# Altium schematic sheet Leningrad.SchDoc
size A1
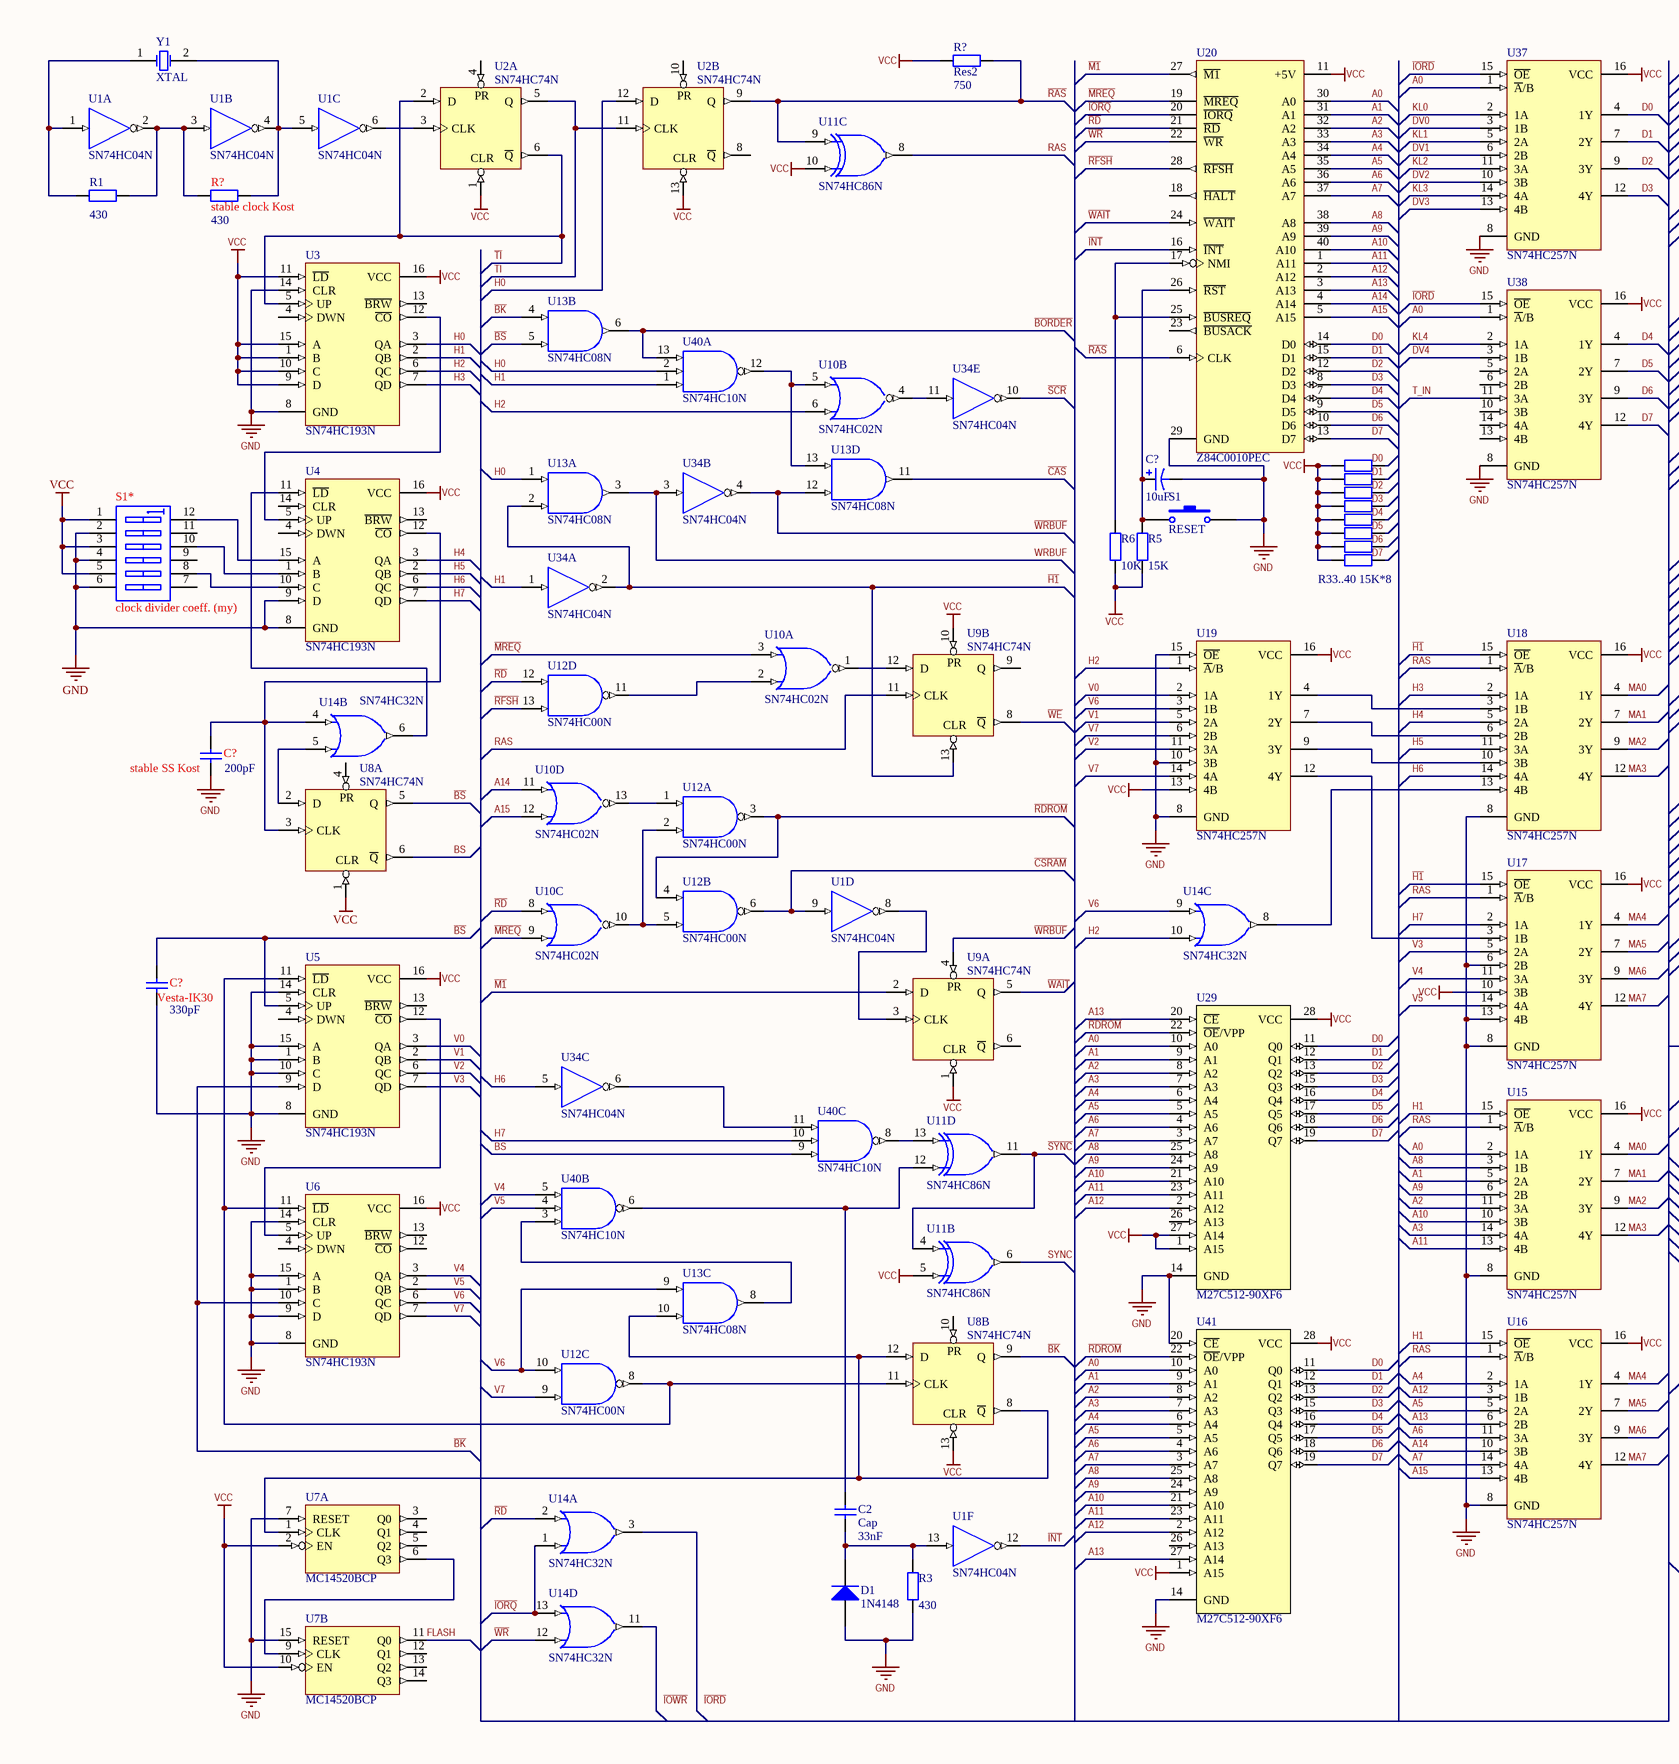
[diagram p0: Leningrad.SchDoc, left]
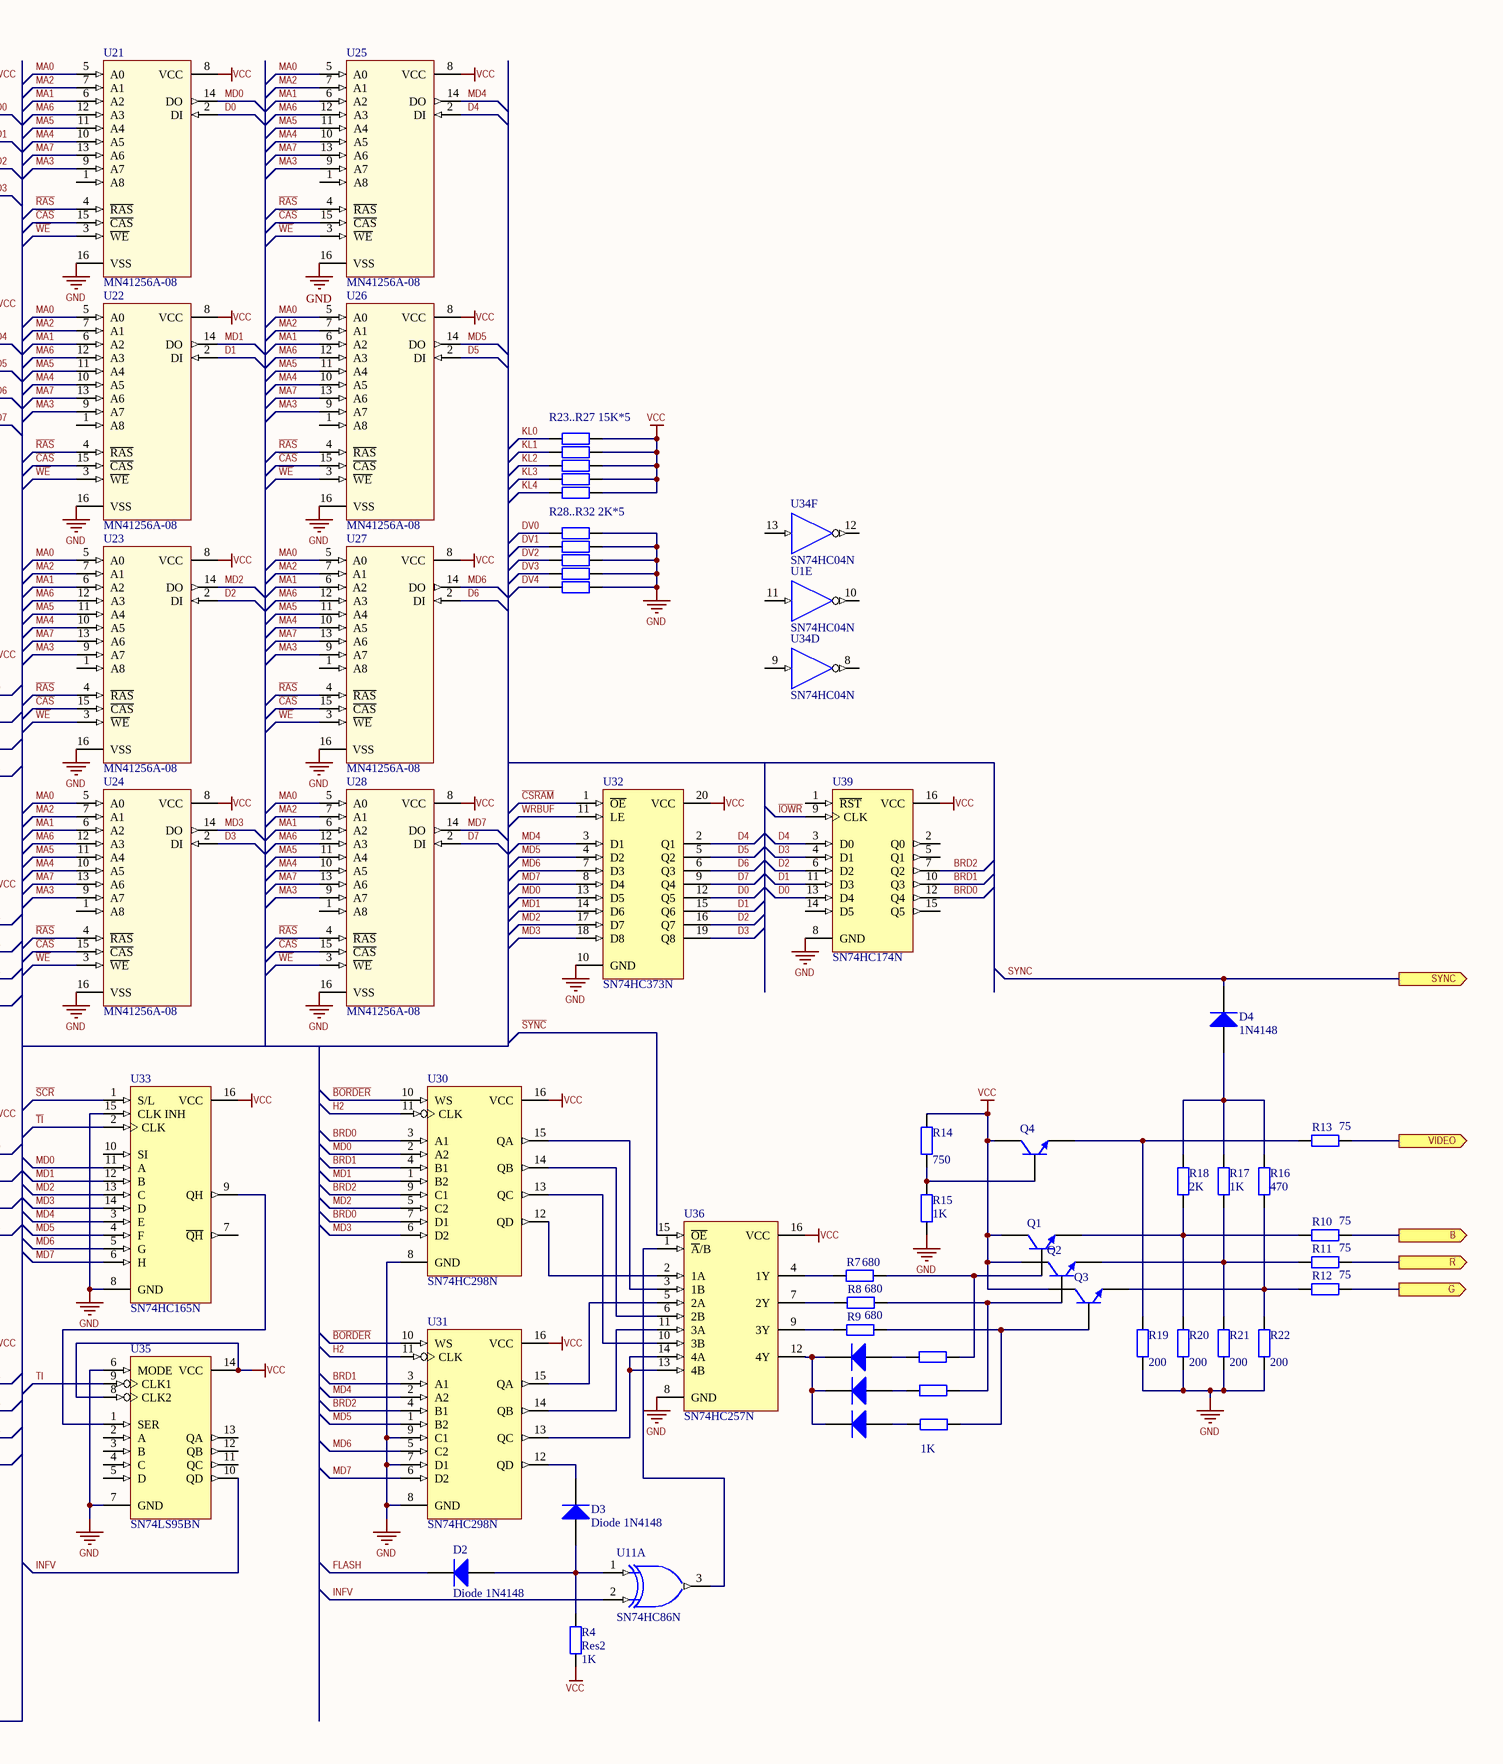
[diagram p1: Leningrad.SchDoc, right]

## Parts
(Parts that share a designator on the sheet are numbered #1, #2 ... from top to bottom, then left to right.)
C2  Cap  value 33nF  [RAD-0.3]
C?#1  value 10uF  [RB7.6-15]  (hidden comment: Cap Pol1)
C?#2  stable SS Kost  value 200pF  [RAD-0.3]
C?#3  Vesta-IK30  value 330pF  [RAD-0.3]
D1  1N4148  [DO-35]
D2  Diode 1N4148  [DO-35]
D3  Diode 1N4148  [DO-35]
D4  1N4148  [DO-35]
D5  1N4148  [DO-35]  (value not drawn)
D6  1N4148  [DO-35]  (value not drawn)
D7  1N4148  [DO-35]  (value not drawn)
Q1  2N3904  [TO-92A]  (value not drawn)
Q2  2N3904  [TO-92A]  (value not drawn)
Q3  2N3904  [TO-92A]  (value not drawn)
Q4  2N3904  [TO-92A]  (value not drawn)
R1  value 430  [AXIAL-0.4]  (hidden comment: Res2)
R3  value 430  [AXIAL-0.4]  (hidden comment: Res2)
R4  Res2  value 1K  [AXIAL-0.4]
R5  value 15K  [AXIAL-0.4]  (hidden comment: Res2)
R6  value 10K  [AXIAL-0.4]  (hidden comment: Res2)
R7  value 680  [AXIAL-0.4]  (hidden comment: Res2)
R8  value 680  [AXIAL-0.4]  (hidden comment: Res2)
R9  value 680  [AXIAL-0.4]  (hidden comment: Res2)
R10  value 75  [AXIAL-0.4]  (hidden comment: Res2)
R11  value 75  [AXIAL-0.4]  (hidden comment: Res2)
R12  value 75  [AXIAL-0.4]  (hidden comment: Res2)
R13  value 75  [AXIAL-0.4]  (hidden comment: Res2)
R14  value 750  [AXIAL-0.4]  (hidden comment: Res2)
R15  value 1K  [AXIAL-0.4]  (hidden comment: Res2)
R16  value 470  [AXIAL-0.4]  (hidden comment: Res2)
R17  value 1K  [AXIAL-0.4]  (hidden comment: Res2)
R18  value 2K  [AXIAL-0.4]  (hidden comment: Res2)
R19  value 200  [AXIAL-0.4]  (hidden comment: Res2)
R20  value 200  [AXIAL-0.4]  (hidden comment: Res2)
R21  value 200  [AXIAL-0.4]  (hidden comment: Res2)
R22  value 200  [AXIAL-0.4]  (hidden comment: Res2)
R23  Res2  [AXIAL-0.4]  (value not drawn)
R24  Res2  [AXIAL-0.4]  (value not drawn)
R25  Res2  [AXIAL-0.4]  (value not drawn)
R26  Res2  [AXIAL-0.4]  (value not drawn)
R27  Res2  [AXIAL-0.4]  (value not drawn)
R28  Res2  [AXIAL-0.4]  (value not drawn)
R29  Res2  [AXIAL-0.4]  (value not drawn)
R30  Res2  [AXIAL-0.4]  (value not drawn)
R31  Res2  [AXIAL-0.4]  (value not drawn)
R32  Res2  [AXIAL-0.4]  (value not drawn)
R33  Res2  [AXIAL-0.4]  (value not drawn)
R34  Res2  [AXIAL-0.4]  (value not drawn)
R35  Res2  [AXIAL-0.4]  (value not drawn)
R36  Res2  [AXIAL-0.4]  (value not drawn)
R37  Res2  [AXIAL-0.4]  (value not drawn)
R38  Res2  [AXIAL-0.4]  (value not drawn)
R39  Res2  [AXIAL-0.4]  (value not drawn)
R40  Res2  [AXIAL-0.4]  (value not drawn)
R41  Res2  [AXIAL-0.4]  (value not drawn)
R42  Res2  [AXIAL-0.4]  (value not drawn)
R43  value 1K  [AXIAL-0.4]  (hidden comment: Res2)
R?#1  Res2  value 750  [AXIAL-0.4]
R?#2  stable clock Kost  value 430  [AXIAL-0.4]
S1  RESET  [SPST-2]
S1*  clock divider coeff. (my)  [DIP-12/SW]  (graphical)
U1  SN74HC04N  [N014]  (parts A,B,C,D,E,F of 6)
U2  SN74HC74N  [N014]  (parts A,B of 2)
U3  SN74HC193N  [N016]
U4  SN74HC193N  [N016]
U5  SN74HC193N  [N016]
U6  SN74HC193N  [N016]
U7  MC14520BCP  [648-08]  (parts A,B of 2)
U8  SN74HC74N  [N014]  (parts A,B of 2)
U9  SN74HC74N  [N014]  (parts A,B of 2)
U10  SN74HC02N  [N014]  (parts A,B,C,D of 4)
U11  SN74HC86N  [N014]  (parts A,B,C,D of 4)
U12  SN74HC00N  [N014]  (parts A,B,C,D of 4)
U13  SN74HC08N  [N014]  (parts A,B,C,D of 4)
U14  SN74HC32N  [N014]  (parts A,B,C,D of 4)
U15  SN74HC257N  [N016]
U16  SN74HC257N  [N016]
U17  SN74HC257N  [N016]
U18  SN74HC257N  [N016]
U19  SN74HC257N  [N016]
U20  Z84C0010PEC  [PDIP40]
U21  MN41256A-08
U22  MN41256A-08
U23  MN41256A-08
U24  MN41256A-08
U25  MN41256A-08
U26  MN41256A-08
U27  MN41256A-08
U28  MN41256A-08
U29  M27C512-90XF6  [FDIP28W]
U30  SN74HC298N  [N016D]
U31  SN74HC298N  [N016D]
U32  SN74HC373N  [N020]
U33  SN74HC165N  [N016]
U34  SN74HC04N  [N014]  (parts A,B,C,D,E,F of 6)
U35  SN74LS95BN  [N014]
U36  SN74HC257N  [N016]
U37  SN74HC257N  [N016]
U38  SN74HC257N  [N016]
U39  SN74HC174N  [N016]
U40  SN74HC10N  [N014]  (parts A,B,C of 3)
U41  M27C512-90XF6  [FDIP28W]
Y1  XTAL  [R38]

## Ports
B (out), G (out), R (out), SYNC (out), VIDEO (out)

## Nets
GND: C?#1.2 C?#2.1 C?#3.1 D1.1(A) R3.1 R15.1 R19.1 R20.1 R21.1 R22.1 R28.2 R29.2 R30.2 R31.2 R32.2 S1.2 S1*.2(A2) S1*.4(A4) S1*.6(A6) U1.7(GND) U2.7(GND) U3.8(GND) U3.14(CLR) U4.8(GND) U4.9(D) U5.1(B) U5.8(GND) U5.10(C) U5.14(CLR) U5.15(A) U6.1(B) U6.8(GND) U6.9(D) U6.14(CLR) U6.15(A) U7.7(RESET) U7.8(GND) U7.15(RESET) U8.7(GND) U9.7(GND) U10.7(GND) U11.7(GND) U12.7(GND) U13.7(GND) U14.7(GND) U15.8(GND) U16.8(GND) U17.6(2B) U17.8(GND) U17.13(4B) U18.8(GND) U19.8(GND) U19.10(3B) U19.15(~{OE}) U20.29(GND) U21.16(VSS) U22.16(VSS) U23.16(VSS) U24.16(VSS) U25.16(VSS) U26.16(VSS) U27.16(VSS) U28.16(VSS) U29.14(GND) U30.8(GND) U31.7(D1) U31.8(GND) U31.9(C1) U32.10(GND) U33.8(GND) U33.15(CLK_INH) U34.7(GND) U35.6(MODE) U35.7(GND) U36.8(GND) U37.8(GND) U38.8(GND) U39.8(GND) U40.7(GND) U41.14(GND) U41.20(~{CE})
VCC: Q1.3(C) Q2.3(C) Q3.3(C) Q4.3(C) R4.1 R5.1 R6.1 R14.2 R23.2 R24.2 R25.2 R26.2 R27.2 R33.1 R34.1 R35.1 R36.1 R37.1 R38.1 R39.1 R40.1 R?#1.1 S1*.1(A1) S1*.3(A3) S1*.5(A5) U1.14(VCC) U2.1(CLR) U2.13(CLR) U2.14(VCC) U3.1(B) U3.9(D) U3.10(C) U3.11(~{LD}) U3.15(A) U3.16(VCC) U4.16(VCC) U5.16(VCC) U6.16(VCC) U7.2(EN) U7.10(EN) U8.1(CLR) U8.13(CLR) U8.14(VCC) U9.1(CLR) U9.10(PR) U9.14(VCC) U10.14(VCC) U11.5(B) U11.10(B) U11.14(VCC) U12.14(VCC) U13.14(VCC) U14.14(VCC) U15.16(VCC) U16.16(VCC) U17.10(3B) U17.16(VCC) U18.16(VCC) U19.13(4B) U19.16(VCC) U20.11(+5V) U21.8(VCC) U22.8(VCC) U23.8(VCC) U24.8(VCC) U25.8(VCC) U26.8(VCC) U27.8(VCC) U28.8(VCC) U29.1(A15) U29.27(A14) U29.28(VCC) U30.16(VCC) U31.16(VCC) U32.20(VCC) U33.16(VCC) U34.14(VCC) U35.8(CLK2) U35.14(VCC) U36.16(VCC) U37.16(VCC) U38.16(VCC) U39.16(VCC) U40.14(VCC) U41.1(A15) U41.28(VCC)
VDD: U7.16(VDD)
A0: U15.2(1A) U20.30(A0) U29.10(A0) U37.1(~{A}/B) U38.1(~{A}/B) U41.10(A0)
A1: U15.5(2A) U20.31(A1) U29.9(A1) U41.9(A1)
A2: U15.11(3A) U20.32(A2) U29.8(A2) U41.8(A2)
A3: U15.14(4A) U20.33(A3) U29.7(A3) U41.7(A3)
A4: U16.2(1A) U20.34(A4) U29.6(A4) U41.6(A4)
A5: U16.5(2A) U20.35(A5) U29.5(A5) U41.5(A5)
A6: U16.11(3A) U20.36(A6) U29.4(A6) U41.4(A6)
A7: U16.14(4A) U20.37(A7) U29.3(A7) U41.3(A7)
A8: U15.3(1B) U20.38(A8) U29.25(A8) U41.25(A8)
A9: U15.6(2B) U20.39(A9) U29.24(A9) U41.24(A9)
A10: U15.10(3B) U20.40(A10) U29.21(A10) U41.21(A10)
A11: U15.13(4B) U20.1(A11) U29.23(A11) U41.23(A11)
A12: U16.3(1B) U20.2(A12) U29.2(A12) U41.2(A12)
A13: U16.6(2B) U20.3(A13) U29.20(~{CE}) U41.27(A14)
A14: U10.11(A) U16.10(3B) U20.4(A14)
A15: U10.12(B) U16.13(4B) U20.5(A15)
B: R10.2 ; port B
~{BK}: U5.9(D) U6.10(C) U8.9(Q) U13.4(A)
~{BORDER}: U13.6(Y) U30.10(WS) U31.10(WS) U40.13(C)
~{BS}: C?#3.2 U5.5(UP) U8.5(Q) U13.5(B)
BRD0: U30.3(A1) U30.7(D1) U39.12(Q4)
BRD1: U30.4(B1) U31.3(A1) U39.10(Q3)
BRD2: U30.9(C1) U31.4(B1) U39.7(Q2)
BS: U8.6(~{Q}) U40.9(A)
~{CAS}: U13.11(Y) U21.15(~{CAS}) U22.15(~{CAS}) U23.15(~{CAS}) U24.15(~{CAS}) U25.15(~{CAS}) U26.15(~{CAS}) U27.15(~{CAS}) U28.15(~{CAS})
~{CSRAM}: U1.9(A) U12.6(Y) U32.1(~{OE})
D0: U20.14(D0) U21.2(DI) U29.11(Q0) U32.12(Q5) U37.4(1Y) U39.13(D4) U41.11(Q0)
D1: U20.15(D1) U22.2(DI) U29.12(Q1) U32.15(Q6) U37.7(2Y) U39.11(D3) U41.12(Q1)
D2: U20.12(D2) U23.2(DI) U29.13(Q2) U32.16(Q7) U37.9(3Y) U39.6(D2) U41.13(Q2)
D3: U20.8(D3) U24.2(DI) U29.15(Q3) U32.19(Q8) U37.12(4Y) U39.4(D1) U41.15(Q3)
D4: U20.7(D4) U25.2(DI) U29.16(Q4) U32.2(Q1) U38.4(1Y) U39.3(D0) U41.16(Q4)
D5: U20.9(D5) U26.2(DI) U29.17(Q5) U32.5(Q2) U38.7(2Y) U41.17(Q5)
D6: U20.10(D6) U27.2(DI) U29.18(Q6) U32.6(Q3) U38.9(3Y) U41.18(Q6)
D7: U20.13(D7) U28.2(DI) U29.19(Q7) U32.9(Q4) U38.12(4Y) U41.19(Q7)
DV0: R28.1 U37.3(1B)
DV1: R29.1 U37.6(2B)
DV2: R30.1 U37.10(3B)
DV3: R31.1 U37.13(4B)
DV4: R32.1 U38.3(1B)
FLASH: D2.2(K) U7.11(Q0)
G: R12.2 ; port G
H0: U2.12(D) U3.3(QA) U13.1(A) U40.2(B)
H1: U3.2(QB) U15.15(~{OE}) U16.15(~{OE}) U34.1(A) U40.1(A)
H2: U3.6(QC) U10.6(B) U14.10(B) U19.1(~{A}/B) U30.11(CLK) U31.11(CLK)
H3: U3.7(QD) U18.2(1A)
H4: U4.3(QA) U18.5(2A)
H5: U4.2(QB) U18.11(3A)
H6: U4.6(QC) U18.14(4A) U34.5(A)
H7: U4.7(QD) U17.2(1A) U40.10(B)
~{H1}: U9.13(CLR) U13.2(B) U17.15(~{OE}) U18.15(~{OE}) U34.2(Y)
~{INT}: U1.12(Y) U20.16(~{INT})
~{IORD}: U37.15(~{OE}) U38.15(~{OE})
~{IORQ}: U14.1(A) U14.13(B) U20.20(~{IORQ})
~{IOWR}: U39.9(CLK)
INFV: U11.2(B) U35.10(QD)
KL0: R23.1 U37.2(1A)
KL1: R24.1 U37.5(2A)
KL2: R25.1 U37.11(3A)
KL3: R26.1 U37.14(4A)
KL4: R27.1 U38.2(1A)
~{M1}: U9.2(D) U20.27(~{M1})
~{MREQ}: U10.3(B) U10.9(B) U20.19(~{MREQ})
MA0: U15.4(1Y) U18.4(1Y) U21.5(A0) U22.5(A0) U23.5(A0) U24.5(A0) U25.5(A0) U26.5(A0) U27.5(A0) U28.5(A0)
MA1: U15.7(2Y) U18.7(2Y) U21.6(A2) U22.6(A2) U23.6(A2) U24.6(A2) U25.6(A2) U26.6(A2) U27.6(A2) U28.6(A2)
MA2: U15.9(3Y) U18.9(3Y) U21.7(A1) U22.7(A1) U23.7(A1) U24.7(A1) U25.7(A1) U26.7(A1) U27.7(A1) U28.7(A1)
MA3: U15.12(4Y) U18.12(4Y) U21.9(A7) U22.9(A7) U23.9(A7) U24.9(A7) U25.9(A7) U26.9(A7) U27.9(A7) U28.9(A7)
MA4: U16.4(1Y) U17.4(1Y) U21.10(A5) U22.10(A5) U23.10(A5) U24.10(A5) U25.10(A5) U26.10(A5) U27.10(A5) U28.10(A5)
MA5: U16.7(2Y) U17.7(2Y) U21.11(A4) U22.11(A4) U23.11(A4) U24.11(A4) U25.11(A4) U26.11(A4) U27.11(A4) U28.11(A4)
MA6: U16.9(3Y) U17.9(3Y) U21.12(A3) U22.12(A3) U23.12(A3) U24.12(A3) U25.12(A3) U26.12(A3) U27.12(A3) U28.12(A3)
MA7: U16.12(4Y) U17.12(4Y) U21.13(A6) U22.13(A6) U23.13(A6) U24.13(A6) U25.13(A6) U26.13(A6) U27.13(A6) U28.13(A6)
MD0: U21.14(DO) U30.2(A2) U32.13(D5) U33.11(A)
MD1: U22.14(DO) U30.1(B2) U32.14(D6) U33.12(B)
MD2: U23.14(DO) U30.5(C2) U32.17(D7) U33.13(C)
MD3: U24.14(DO) U30.6(D2) U32.18(D8) U33.14(D)
MD4: U25.14(DO) U31.2(A2) U32.3(D1) U33.3(E)
MD5: U26.14(DO) U31.1(B2) U32.4(D2) U33.4(F)
MD6: U27.14(DO) U31.5(C2) U32.7(D3) U33.5(G)
MD7: U28.14(DO) U31.6(D2) U32.8(D4) U33.6(H)
R: R11.2 ; port R
~{RAS}: R?#1.2 U2.9(Q) U11.9(A) U20.6(CLK) U21.4(~{RAS}) U22.4(~{RAS}) U23.4(~{RAS}) U24.4(~{RAS}) U25.4(~{RAS}) U26.4(~{RAS}) U27.4(~{RAS}) U28.4(~{RAS})
~{RD}: U10.8(A) U12.12(A) U14.2(B) U20.21(~{RD})
~{RDROM}: U12.3(Y) U12.4(A) U29.22(~{OE}/VPP) U41.22(~{OE}/VPP)
~{RFSH}: U12.13(B) U20.28(~{RFSH})
RAS: U9.11(CLK) U11.8(Y) U15.1(~{A}/B) U16.1(~{A}/B) U17.1(~{A}/B) U18.1(~{A}/B)
~{SCR}: U33.1(S/L) U34.10(Y)
~{SYNC}: U11.4(A) U11.11(Y) U36.15(~{OE})
SYNC: D4.2(K) U11.6(Y) ; port SYNC
~{TI}: U2.2(D) U2.6(~{Q}) U3.5(UP) U33.2(CLK)
T_IN: U38.11(3A)
TI: U2.5(Q) U2.11(CLK) U35.9(CLK1)
V0: U5.3(QA) U19.2(1A)
V1: U5.2(QB) U19.5(2A)
V2: U5.6(QC) U19.11(3A)
V3: U5.7(QD) U17.5(2A)
V4: U6.3(QA) U17.11(3A) U40.5(C)
V5: U6.2(QB) U17.14(4A) U40.4(B)
V6: U6.6(QC) U12.10(B) U13.9(A) U14.9(A) U19.3(1B)
V7: U6.7(QD) U12.9(A) U19.6(2B) U19.14(4A)
VIDEO: R13.2 ; port VIDEO
~{WAIT}: U9.5(Q) U20.24(~{WAIT})
~{WE}: U9.8(~{Q}) U21.3(~{WE}) U22.3(~{WE}) U23.3(~{WE}) U24.3(~{WE}) U25.3(~{WE}) U26.3(~{WE}) U27.3(~{WE}) U28.3(~{WE})
~{WR}: U14.12(A) U20.22(~{WR})
~{WRBUF}: U9.4(PR) U13.12(A) U34.4(Y)
WRBUF: U13.3(Y) U32.11(LE) U34.3(A)
NetC2_1: C2.1 D1.2(K) R3.2 U1.13(A)
NetC2_2: C2.2 U11.12(A) U40.6(Y)
NetC?#1_1: C?#1.1 R5.2 S1.1 U20.26(~{RST})
NetC?#2_2: C?#2.2 U4.12(~{CO}) U8.3(CLK) U14.4(A)
NetD2_1: D2.1(A) D3.1(A) R4.2 U11.1(A)
NetD3_2: D3.2(K) U31.12(QD)
NetD4_1: D4.1(A) R16.2 R17.2 R18.2
NetD5_1: D5.1(A) R41.1
NetD5_2: D5.2(K) D6.2(K) D7.2(K) U36.12(4Y)
NetD6_1: D6.1(A) R42.1
NetD7_1: D7.1(A) R43.1
NetQ1_1: Q1.1(E) R10.1 R18.1 R20.2
NetQ1_2: Q1.2(B) R7.2 R41.2
NetQ2_1: Q2.1(E) R11.1 R17.1 R21.2
NetQ2_2: Q2.2(B) R8.2 R42.2
NetQ3_1: Q3.1(E) R12.1 R16.1 R22.2
NetQ3_2: Q3.2(B) R9.2 R43.2
NetQ4_1: Q4.1(E) R13.1 R19.2
NetQ4_2: Q4.2(B) R14.1 R15.2
NetR1_1: R1.1 U1.1(A) Y1.1(OSC1)
NetR1_2: R1.2 R?#2.1 U1.2(Y) U1.3(A)
NetR6_2: R6.2 U20.17(NMI) U20.25(~{BUSREQ})
NetR7_1: R7.1 U36.4(1Y)
NetR8_1: R8.1 U36.7(2Y)
NetR9_1: R9.1 U36.9(3Y)
NetR?#2_2: R?#2.2 U1.4(Y) U1.5(A) Y1.2(OSC2)
NetS1*_8: S1*.8(B5) U4.10(C)
NetS1*_10: S1*.10(B3) U4.1(B)
NetS1*_12: S1*.12(B1) U4.15(A)
NetU1_6: U1.6(Y) U2.3(CLK)
NetU1_8: U1.8(Y) U9.3(CLK)
NetU3_12: U3.12(~{CO}) U4.5(UP)
NetU4_11: U4.11(~{LD}) U14.6(Y)
NetU5_11: U5.11(~{LD}) U6.11(~{LD}) U8.11(CLK) U12.8(Y)
NetU5_12: U5.12(~{CO}) U6.5(UP)
NetU7_1: U7.1(CLK) U8.8(~{Q}) U8.12(D) U13.10(B)
NetU7_6: U7.6(Q3) U7.9(CLK)
NetU8_2: U8.2(D) U14.5(B)
NetU9_12: U9.12(D) U10.1(Y)
NetU10_2: U10.2(A) U12.11(Y)
NetU10_4: U10.4(Y) U34.11(A)
NetU10_5: U10.5(A) U13.13(B) U40.12(Y)
NetU10_10: U10.10(Y) U12.2(B) U12.5(B)
NetU10_13: U10.13(Y) U12.1(A)
NetU11_3: U11.3(Y) U36.1(~{A}/B)
NetU11_13: U11.13(B) U40.8(Y)
NetU13_8: U13.8(Y) U40.3(A)
NetU14_8: U14.8(Y) U18.13(4B)
NetU17_3: U17.3(1B) U19.12(4Y)
NetU18_3: U18.3(1B) U19.4(1Y)
NetU18_6: U18.6(2B) U19.7(2Y)
NetU18_10: U18.10(3B) U19.9(3Y)
NetU30_12: U30.12(QD) U36.2(1A)
NetU30_13: U30.13(QC) U36.10(3B)
NetU30_14: U30.14(QB) U36.6(2B)
NetU30_15: U30.15(QA) U36.3(1B)
NetU31_13: U31.13(QC) U36.13(4B) U36.14(4A)
NetU31_14: U31.14(QB) U36.11(3A)
NetU31_15: U31.15(QA) U36.5(2A)
NetU33_9: U33.9(QH) U35.1(SER)
NetU34_6: U34.6(Y) U40.11(C)

Not connected (* = marked no-connect by the designer): R33 2; R34 2; R35 2; R36 2; R37 2; R38 2; R39 2; R40 2; S1* 7(B6) 9(B4) 11(B2); U1 10(Y) 11(A); U2 4(PR) 8(~{Q}) 10(PR); U3 4(DWN) 13(~{BRW}); U4 4(DWN) 13(~{BRW}) 14(CLR); U5 4(DWN) 13(~{BRW}); U6 4(DWN) 12(~{CO}) 13(~{BRW}); U7 3(Q0) 4(Q1) 5(Q2) 12(Q1) 13(Q2) 14(Q3); U8 4(PR) 10(PR); U9 6(~{Q}) 9(Q); U14 3(Y) 11(Y); U20 18(~{HALT}) 23(~{BUSACK}); U21 1(A8); U22 1(A8); U23 1(A8); U24 1(A8); U25 1(A8); U26 1(A8); U27 1(A8); U28 1(A8); U29 26(A13); U33 7(~{QH}) 10(SI); U34 8(Y) 9(A) 12(Y) 13(A); U35 2(A) 3(B) 4(C) 5(D) 11(QC) 12(QB) 13(QA); U38 5(2A) 6(2B) 10(3B) 13(4B) 14(4A); U39 1(~{RST}) 2(Q0) 5(Q1) 14(D5) 15(Q5); U41 26(A13)

## Notes on the sheet
- (near R23) R23..R27 15K*5
- R28..R32 2K*5
- (near R40) R33..40 15K*8
- Labels drawn without touching a wire or pin: D0, D1, D2, D3, D4, D5, D6, D7, ~{IORD}, ~{IOWR}

## Library data of the parts
C2 C?#2 C?#3 = Cap: Capacitor; Published: 8-Jun-2000; LatestRevisionDate: 17-Jul-2002; LatestRevisionNote: Re-released for DXP Platform.; PackageReference: RAD-0.3; Publisher: Altium Limited; PackageDescription: Radial Cap, Thru-Hole; 2 Leads; 0.3 in Pin Spacing
C?#1 = Cap Pol1: Polarized Capacitor (Radial); Published: 8-Jun-2000; LatestRevisionDate: 17-Jul-2002; LatestRevisionNote: Re-released for DXP Platform.; PackageReference: RB7.6-15; Publisher: Altium Limited; PackageDescription: Polarized Capacitor (Radial); 2 Leads
D1-D7 = Diode 1N4148: High Conductance Fast Diode; Published: 8-Jun-2000; LatestRevisionDate: 17-Jul-2002; LatestRevisionNote: Re-released for DXP Platform.; DatasheetVersion: 1997; PackageReference: DO-35; Publisher: Altium Limited; PackageDescription: Diode, Axial; Body 3.8 x 1.9 mm (LxDia. max), Lead Dia. 0.53 mm (max); Code_JEDEC: DO-204-AH; ComponentLink1Description: Manufacturer Link; ComponentLink1URL: http://www.fairchildsemi.com/; ComponentLink2Description: Datasheet; ComponentLink2URL: http://www.fairchildsemi.com/ds/1N%2F1N4148.pdf
Q1-Q4 = 2N3904: NPN General Purpose Amplifier; Published: 8-Jun-2000; LatestRevisionDate: 15-Jan-2003; LatestRevisionNote: PCB Footprint 'BCY-W3/D4.7' replaced; DatasheetVersion: 1997; PackageVersion: Sep-1998; PackageReference: TO-92A; Publisher: Altium Limited; PackageDescription: TO, Flat Index; 3 In-Line, Axial Leads; Body Dia. 4.5mm; Leads 0.51 x 0.48 mm (max); ComponentLink1Description: Manufacturer Link; ComponentLink1URL: http://www.fairchildsemi.com/; ComponentLink2Description: Datasheet; ComponentLink2URL: http://www.fairchildsemi.com/ds/2N%2F2N3904.pdf
R1 R3-R22 R43 R?#1 R?#2 = Res2: Resistor; Published: 8-Jun-2000; LatestRevisionDate: 17-Jul-2002; LatestRevisionNote: Re-released for DXP Platform.; PackageReference: AXIAL-0.4; Publisher: Altium Limited; PackageDescription: Axial Device, Thru-Hole; 2 Leads; 0.4 in Pin Spacing
R23-R27 R33-R40 = Res2: Resistor; Value: 15K; Published: 8-Jun-2000; LatestRevisionDate: 17-Jul-2002; LatestRevisionNote: Re-released for DXP Platform.; PackageReference: AXIAL-0.4; Publisher: Altium Limited; PackageDescription: Axial Device, Thru-Hole; 2 Leads; 0.4 in Pin Spacing
R28-R32 = Res2: Resistor; Value: 2K; Published: 8-Jun-2000; LatestRevisionDate: 17-Jul-2002; LatestRevisionNote: Re-released for DXP Platform.; PackageReference: AXIAL-0.4; Publisher: Altium Limited; PackageDescription: Axial Device, Thru-Hole; 2 Leads; 0.4 in Pin Spacing
R41 R42 = Res2: Resistor; Value: 1K; Published: 8-Jun-2000; LatestRevisionDate: 17-Jul-2002; LatestRevisionNote: Re-released for DXP Platform.; PackageReference: AXIAL-0.4; Publisher: Altium Limited; PackageDescription: Axial Device, Thru-Hole; 2 Leads; 0.4 in Pin Spacing
S1 = SW-PB: Switch; Published: 24-Mar-1999; LatestRevisionDate: 17-Jul-2002; LatestRevisionNote: Re-released for DXP Platform.; PackageReference: SPST-2; Publisher: Altium Limited; PackageDescription: Switch; 2 Leads
S1* = SW DIP-6: DIP Switch, 6 Position, SPST; Published: 24-Mar-1999; LatestRevisionDate: 17-Jul-2002; LatestRevisionNote: Re-released for DXP Platform.; PackageReference: DIP-12/SW; Publisher: Altium Limited; PackageDescription: DIP Switch; 12 Leads
U1 U34 = SN74HC04N: Hex Inverter; Published: 8-Jun-2000; LatestRevisionDate: 04-Mar-2005; LatestRevisionNote: Stylized 3D Model Added.; DatasheetVersion: May-1997; PackageVersion: Oct-1995; PackageReference: N014; Publisher: Altium Limited; PackageDescription: DIP; 14 Leads; Row Spacing 7.62 mm; Pitch 2.54 mm; ComponentLink1Description: Manufacturer Link; ComponentLink1URL: http://www.ti.com/; ComponentLink2Description: Datasheet; ComponentLink2URL: http://www-s.ti.com/sc/ds/sn74hc04.pdf
U2 U8 U9 = SN74HC74N: Dual D-Type Positive-Edge-Triggered Flip-Flop with Clear and Preset; Published: 8-Jun-2000; LatestRevisionDate: 04-Mar-2005; LatestRevisionNote: Stylized 3D Model Added.; DatasheetVersion: May-1997; PackageVersion: Oct-1995; PackageReference: N014; Publisher: Altium Limited; PackageDescription: DIP; 14 Leads; Row Spacing 7.62 mm; Pitch 2.54 mm; ComponentLink1Description: Manufacturer Link; ComponentLink1URL: http://www.ti.com/; ComponentLink2Description: Datasheet; ComponentLink2URL: http://www-s.ti.com/sc/ds/sn74hc74.pdf
U3-U6 = SN74HC193N: 4-Bit Synchronous Up/Down Counter (Dual Clock with Clear); Published: 8-Jun-2000; LatestRevisionDate: 04-Mar-2005; LatestRevisionNote: Stylized 3D Model Added.; DatasheetVersion: May-1997; PackageVersion: Oct-1995; PackageReference: N016; Publisher: Altium Limited; PackageDescription: DIP; 16 Leads; Row Spacing 7.62 mm; Pitch 2.54 mm; Code_JEDEC: MS-001-BB; ComponentLink1Description: Manufacturer Link; ComponentLink1URL: http://www.ti.com/; ComponentLink2Description: Datasheet; ComponentLink2URL: http://www-s.ti.com/sc/ds/sn74hc193.pdf
U7 = MC14520BCP: Dual Binary Up Counter; Published: 15-Apr-2002; DatasheetVersion: 1995; PackageVersion: Apr-2000; PackageReference: 648-08; Publisher: Altium Limited; PackageDescription: DIP; 16 Leads; Row Spacing 7.62 mm; Pitch 2.54 mm; Code_JEDEC: MS-001-BB; ComponentLink1Description: Manufacturer Link; ComponentLink1URL: http://www.onsemi.com/; ComponentLink2Description: Datasheet; ComponentLink2URL: http://www.onsemi.com/pub/Collateral/MC14518B-D.PDF
U10 = SN74HC02N: Quadruple 2-Input Positive-NOR Gate; Published: 8-Jun-2000; LatestRevisionDate: 04-Mar-2005; LatestRevisionNote: Stylized 3D Model Added.; DatasheetVersion: May-1997; PackageVersion: Oct-1995; PackageReference: N014; Publisher: Altium Limited; PackageDescription: DIP; 14 Leads; Row Spacing 7.62 mm; Pitch 2.54 mm; ComponentLink1Description: Manufacturer Link; ComponentLink1URL: http://www.ti.com/; ComponentLink2Description: Datasheet; ComponentLink2URL: http://www-s.ti.com/sc/ds/sn74hc02.pdf
U11 = SN74HC86N: Quadruple 2-Input Exclusive-OR Gate; Published: 8-Jun-2000; LatestRevisionDate: 04-Mar-2005; LatestRevisionNote: Stylized 3D Model Added.; DatasheetVersion: Aug-1999; PackageVersion: Oct-1995; PackageReference: N014; Publisher: Altium Limited; PackageDescription: DIP; 14 Leads; Row Spacing 7.62 mm; Pitch 2.54 mm; ComponentLink1Description: Manufacturer Link; ComponentLink1URL: http://www.ti.com/; ComponentLink2Description: Datasheet; ComponentLink2URL: http://www-s.ti.com/sc/ds/SN54HC86.pdf
U12 = SN74HC00N: Quadruple 2-Input Positive-NAND Gate; Published: 8-Jun-2000; LatestRevisionDate: 04-Mar-2005; LatestRevisionNote: Stylized 3D Model Added.; DatasheetVersion: May-1997; PackageVersion: Oct-1995; PackageReference: N014; Publisher: Altium Limited; PackageDescription: DIP; 14 Leads; Row Spacing 7.62 mm; Pitch 2.54 mm; ComponentLink1Description: Manufacturer Link; ComponentLink1URL: http://www.ti.com/; ComponentLink2Description: Datasheet; ComponentLink2URL: http://www-s.ti.com/sc/ds/sn74hc00.pdf
U13 = SN74HC08N: Quadruple 2-Input Positive-AND Gate; Published: 8-Jun-2000; LatestRevisionDate: 04-Mar-2005; LatestRevisionNote: Stylized 3D Model Added.; DatasheetVersion: May-1997; PackageVersion: Oct-1995; PackageReference: N014; Publisher: Altium Limited; PackageDescription: DIP; 14 Leads; Row Spacing 7.62 mm; Pitch 2.54 mm; ComponentLink1Description: Manufacturer Link; ComponentLink1URL: http://www.ti.com/; ComponentLink2Description: Datasheet; ComponentLink2URL: http://www-s.ti.com/sc/ds/SN74HC08.pdf
U14 = SN74HC32N: Quadruple 2-Input Positive-OR Gate; Published: 8-Jun-2000; LatestRevisionDate: 04-Mar-2005; LatestRevisionNote: Stylized 3D Model Added.; DatasheetVersion: May-1997; PackageVersion: Oct-1995; PackageReference: N014; Publisher: Altium Limited; PackageDescription: DIP; 14 Leads; Row Spacing 7.62 mm; Pitch 2.54 mm; ComponentLink1Description: Manufacturer Link; ComponentLink1URL: http://www.ti.com/; ComponentLink2Description: Datasheet; ComponentLink2URL: http://www-s.ti.com/sc/ds/sn74hc32.pdf
U15-U19 U36-U38 = SN74HC257N: Quadruple 2-Line to 1-Line Data Selector/Multiplexer with 3-State Outputs; Published: 8-Jun-2000; LatestRevisionDate: 04-Mar-2005; LatestRevisionNote: Stylized 3D Model Added.; DatasheetVersion: Jun-1989; PackageVersion: Oct-1995; PackageReference: N016; Publisher: Altium Limited; PackageDescription: DIP; 16 Leads; Row Spacing 7.62 mm; Pitch 2.54 mm; Code_JEDEC: MS-001-BB; ComponentLink1Description: Manufacturer Link; ComponentLink1URL: http://www.ti.com/; ComponentLink2Description: Datasheet; ComponentLink2URL: http://www-s.ti.com/sc/ds/sn74hc257.pdf
U20 = Z84C0010PEC: CMOS 8-Bit Microprocessor; Published: 15-Apr-2002; LatestRevisionDate: 04-Mar-2005; LatestRevisionNote: Stylized 3D Model Added.; DatasheetVersion: Jan-1989; PackageVersion: Jun-1999; PackageReference: PDIP40; Publisher: Altium Limited; PackageDescription: DIP; 40 Leads; Row Spacing 15.24 mm; Pitch 2.54 mm; ComponentLink1Description: Manufacturer Link; ComponentLink1URL: http://www.zilog.com/; ComponentLink2Description: Datasheet; ComponentLink2URL: http://www.zilog.com/docs/z80/um0081.pdf
U29 U41 = M27C512-90XF6: 512 Kbit (64Kb x 8) UV EPROM and OTP EPROM; Published: 24-Aug-2001; LatestRevisionDate: 06-Jun-2005; LatestRevisionNote: Stylized 3D Model Added.; DatasheetVersion: Nov-1998; PackageReference: FDIP28W; Publisher: Altium Limited; PackageDescription: Ceramic Frit-seal DIP, Window; 28 Leads; Row Spacing 15.24 mm; Pitch 2.54 mm; ComponentLink1Description: Manufacturer Link; ComponentLink1URL: http://www.st.com/; ComponentLink2Description: Datasheet; ComponentLink2URL: http://www.st.com/stonline/products/literature/ds/2387/m27c512.pdf
U30 U31 = SN74HC298N: Quadruple 2-Input Multiplexer with Storage; Published: 8-Jun-2000; LatestRevisionDate: 04-Mar-2005; LatestRevisionNote: Stylized 3D Model Added.; DatasheetVersion: Jun-1989; PackageVersion: Oct-1995; PackageReference: N016D; Publisher: Altium Limited; PackageDescription: DIP; 16 Leads; Row Spacing 7.62 mm; Pitch 2.54 mm; Code_JEDEC: MS-001-BB; ComponentLink1Description: Manufacturer Link; ComponentLink1URL: http://www.ti.com/
U32 = SN74HC373N: Octal Transparent D-Type Latches with 3-State Outputs; Published: 8-Jun-2000; LatestRevisionDate: 04-Mar-2005; LatestRevisionNote: Stylized 3D Model Added.; DatasheetVersion: May-1997; PackageVersion: Oct-1995; PackageReference: N020; Publisher: Altium Limited; PackageDescription: DIP; 20 Leads; Row Spacing 7.62 mm; Pitch 2.54 mm; ComponentLink1Description: Manufacturer Link; ComponentLink1URL: http://www.ti.com/; ComponentLink2Description: Datasheet; ComponentLink2URL: http://www-s.ti.com/sc/ds/sn54hc373.pdf
U33 = SN74HC165N: 8-Bit Parallel-Load Shift Register; Published: 8-Jun-2000; LatestRevisionDate: 04-Mar-2005; LatestRevisionNote: Stylized 3D Model Added.; DatasheetVersion: May-1997; PackageVersion: Oct-1995; PackageReference: N016; Publisher: Altium Limited; PackageDescription: DIP; 16 Leads; Row Spacing 7.62 mm; Pitch 2.54 mm; Code_JEDEC: MS-001-BB; ComponentLink1Description: Manufacturer Link; ComponentLink1URL: http://www.ti.com/; ComponentLink2Description: Datasheet; ComponentLink2URL: http://www-s.ti.com/sc/ds/sn74hc165.pdf
U35 = SN74LS95BN: 4-Bit Parallel-Access Shift Register; ComponentAvailability: Obsolete; Published: 8-Jun-2000; LatestRevisionDate: 04-Mar-2005; LatestRevisionNote: Stylized 3D Model Added.; DatasheetVersion: Mar-1988; PackageVersion: Oct-1995; PackageReference: N014; Publisher: Altium Limited; PackageDescription: DIP; 14 Leads; Row Spacing 7.62 mm; Pitch 2.54 mm; ComponentLink1Description: Manufacturer Link; ComponentLink1URL: http://www.ti.com/; ComponentLink2Description: Datasheet; ComponentLink2URL: http://www-s.ti.com/sc/ds/sn5495a.pdf
U39 = SN74HC174N: Hex D-Type Flip-Flop with Clear; Published: 8-Jun-2000; LatestRevisionDate: 04-Mar-2005; LatestRevisionNote: Stylized 3D Model Added.; DatasheetVersion: May-1997; PackageVersion: Oct-1995; PackageReference: N016; Publisher: Altium Limited; PackageDescription: DIP; 16 Leads; Row Spacing 7.62 mm; Pitch 2.54 mm; Code_JEDEC: MS-001-BB; ComponentLink1Description: Manufacturer Link; ComponentLink1URL: http://www.ti.com/; ComponentLink2Description: Datasheet; ComponentLink2URL: http://www-s.ti.com/sc/ds/sn74hc174.pdf
U40 = SN74HC10N: Triple 3-Input Positive-NAND Gate; Published: 8-Jun-2000; LatestRevisionDate: 04-Mar-2005; LatestRevisionNote: Stylized 3D Model Added.; DatasheetVersion: May-1997; PackageVersion: Oct-1995; PackageReference: N014; Publisher: Altium Limited; PackageDescription: DIP; 14 Leads; Row Spacing 7.62 mm; Pitch 2.54 mm; ComponentLink1Description: Manufacturer Link; ComponentLink1URL: http://www.ti.com/; ComponentLink2Description: Datasheet; ComponentLink2URL: http://www-s.ti.com/sc/ds/sn74hc10.pdf
Y1 = XTAL: Crystal Oscillator; Published: 8-Jun-2000; LatestRevisionDate: 17-Jul-2002; LatestRevisionNote: Re-released for DXP Platform.; PackageReference: R38; Publisher: Altium Limited; PackageDescription: Crystal, Thru-Hole; 2 Leads; Body 3.1 x 8.2 mm (Dia.xH)